# EAGLE design MacroKeypad (EAGLE 9.6.2)
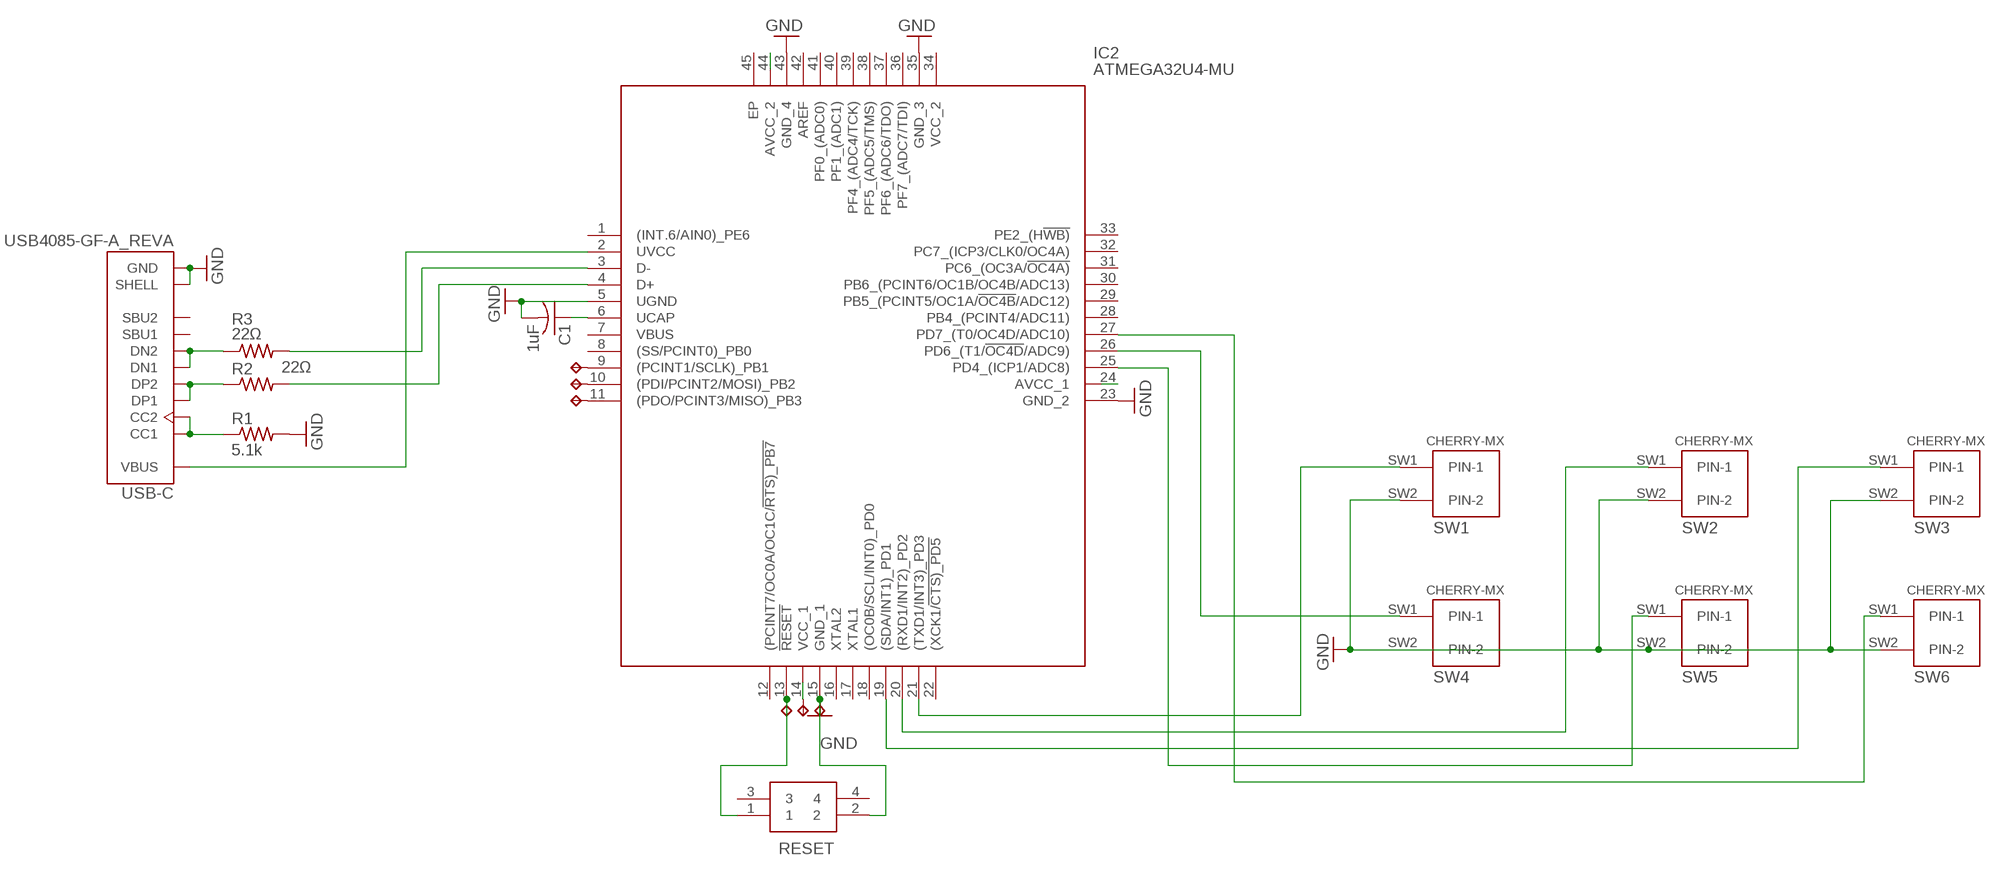
[diagram p0: schematic, sheet 1]

## Parts
5V  TPTP17R  [TP17R]
C1  1uF  C-USC0805  [C0805]
GND  TPTP17R  [TP17R]
IC2  ATMEGA32U4-MU  [QFN50P700X700X100-45N]
MISO  TPTP17R  [TP17R]
MOSI  TPTP17R  [TP17R]
R1  5.1k  R-US_R0603  [R0603]
R2  22Ω  R-US_R0805  [R0805]
R3  22Ω  R-US_R0805  [R0805]
RESET  LL3303F065QG  [LL3303F065QG]
RST  TPTP17R  [TP17R]
SCLK  TPTP17R  [TP17R]
SW1  CHERRY-MX  [CHERRY-MX]
SW2  CHERRY-MX  [CHERRY-MX]
SW3  CHERRY-MX  [CHERRY-MX]
SW4  CHERRY-MX  [CHERRY-MX]
SW5  CHERRY-MX  [CHERRY-MX]
SW6  CHERRY-MX  [CHERRY-MX]
USB-C  USB4085-GF-A_REVA  [GCT_USB4085-GF-A_REVA]

## Nets
CC: R1.1 USB-C.A5(CC1) USB-C.B5(CC2)
D+: R2.1 USB-C.A6(DP1) USB-C.B6(DP2)
D+RES: IC2.4(D+) R2.2
D-: R3.1 USB-C.A7(DN1) USB-C.B7(DN2)
D-RES: IC2.3(D-) R3.2
GND: C1.2 GND.TP IC2.5(UGND) IC2.15(GND_1) IC2.23(GND_2) IC2.35(GND_3) IC2.43(GND_4) R1.2 RESET.2 SW1.SW2(PIN-2) SW2.SW2(PIN-2) SW3.SW2(PIN-2) SW4.SW2(PIN-2) SW5.SW2(PIN-2) SW6.SW2(PIN-2) USB-C.A1(GND) USB-C.A12(GND) USB-C.B1(GND) USB-C.B12(GND) USB-C.P1(SHELL) USB-C.P2(SHELL) USB-C.P3(SHELL) USB-C.P4(SHELL)
MISO: IC2.11((PDO/PCINT3/MISO)_PB3) MISO.TP
MOSI: IC2.10((PDI/PCINT2/MOSI)_PB2) MOSI.TP
RESET: IC2.13(!RESET) RESET.1 RST.TP
SCLK: IC2.9((PCINT1/SCLK)_PB1) SCLK.TP
SW1: IC2.21((TXD1/INT3)_PD3) SW1.SW1(PIN-1)
SW2: IC2.20((RXD1/INT2)_PD2) SW2.SW1(PIN-1)
SW3: IC2.19((SDA/INT1)_PD1) SW3.SW1(PIN-1)
SW4: IC2.26(PD6_(T1/!OC4D!/ADC9)) SW4.SW1(PIN-1)
SW5: IC2.25(PD4_(ICP1/ADC8)) SW5.SW1(PIN-1)
SW6: IC2.27(PD7_(T0/OC4D/ADC10)) SW6.SW1(PIN-1)
UCAP: C1.1 IC2.6(UCAP)
VCC: 5V.TP IC2.14(VCC_1) IC2.24(AVCC_1) IC2.44(AVCC_2)
VIN: IC2.2(UVCC) USB-C.A4(VBUS) USB-C.A9(VBUS) USB-C.B4(VBUS) USB-C.B9(VBUS)
Unconnected: IC2.1((INT.6/AIN0)_PE6) IC2.7(VBUS) IC2.8((SS/PCINT0)_PB0) IC2.12((PCINT7/OC0A/OC1C/!RTS)_PB7) IC2.16(XTAL2) IC2.17(XTAL1) IC2.18((OC0B/SCL/INT0)_PD0) IC2.22((XCK1/!CTS)_PD5) IC2.28(PB4_(PCINT4/ADC11)) IC2.29(PB5_(PCINT5/OC1A/!OC4B!/ADC12)) IC2.30(PB6_(PCINT6/OC1B/OC4B/ADC13)) IC2.31(PC6_(OC3A/!OC4A)) IC2.32(PC7_(ICP3/CLK0/OC4A)) IC2.33(PE2_(H!WB)) IC2.34(VCC_2) IC2.36(PF7_(ADC7/TDI)) IC2.37(PF6_(ADC6/TDO)) IC2.38(PF5_(ADC5/TMS)) IC2.39(PF4_(ADC4/TCK)) IC2.40(PF1_(ADC1)) IC2.41(PF0_(ADC0)) IC2.42(AREF) IC2.45(EP) RESET.3 RESET.4 USB-C.A8(SBU1) USB-C.B8(SBU2)

## Library data of the parts
5V GND MISO MOSI RST SCLK = testpad:TP: Test pad
C1 = adafruit:C-US: CAPACITOR, American symbol
IC2 = SamacSys_Parts:ATMEGA32U4-MU: MCU 8-bit ATmega AVR RISC 32KB Flash Atmel ATMEGA32U4-MU, 8bit AVR Microcontroller, 16MHz, 32 kB Flash, 44-Pin QFN Source: Datasheet <https://componentsearchengine.com/Datasheets/2/ATMEGA32U4-MU.pdf>; DESCRIPTION: MCU 8-bit ATmega AVR RISC 32KB Flash Atmel ATMEGA32U4-MU, 8bit AVR Microcontroller, 16MHz, 32 kB Flash, 44-Pin QFN; HEIGHT: 1mm; MANUFACTURER_NAME: Microchip; MANUFACTURER_PART_NUMBER: ATMEGA32U4-MU; MOUSER_PART_NUMBER: 556-ATMEGA32U4-MU; MOUSER_PRICE-STOCK: https://www.mouser.co.uk/ProductDetail/Microchip-Technology-Atmel/ATMEGA32U4-MU?qs=JV7lzlMm3yJYRpi0cY3cKw%3D%3D
R1-R3 = adafruit:R-US_: RESISTOR, American symbol
RESET = SamacSys_Parts:LL3303F065QG: Pushbutton Switches 50mA 12VDC F065 7.0mm Gull Wing Source: Datasheet <http://spec_sheets.e-switch.com/specs/P090008.pdf>; DESCRIPTION: Pushbutton Switches 50mA 12VDC F065 7.0mm Gull Wing; HEIGHT: 3.4mm; MANUFACTURER_NAME: E-Switch; MANUFACTURER_PART_NUMBER: LL3303F065QG; MOUSER_PART_NUMBER: 612-LL3303F065QG; MOUSER_PRICE-STOCK: https://www.mouser.co.uk/ProductDetail/E-Switch/LL3303F065QG?qs=QtyuwXswaQjocAyEnLyPSg%3D%3D
SW1-SW6 = cherrymx:CHERRY-MX: Cherry MX series keyswitch
USB-C = USB4085-GF-A_REVA:USB4085-GF-A_REVA: USB 2.0 Type C Receptacle Dip Type, PCB Top Mount Check prices <https://pricing.snapeda.com/parts/USB4085-GF-A/Global%20Connector%20Technology/view-part?ref=eda>; AVAILABILITY: Warning; DESCRIPTION: USB-C (USB TYPE-C) USB 2.0 Receptacle Connector 24 (16+8 Dummy) Position Through Hole, Right Angle; MF: Global Connector Technology; MP: USB4085-GF-A; PACKAGE: Package; PRICE: None; PURCHASE-URL: https://pricing.snapeda.com/search/part/USB4085-GF-A/?ref=eda

## Board
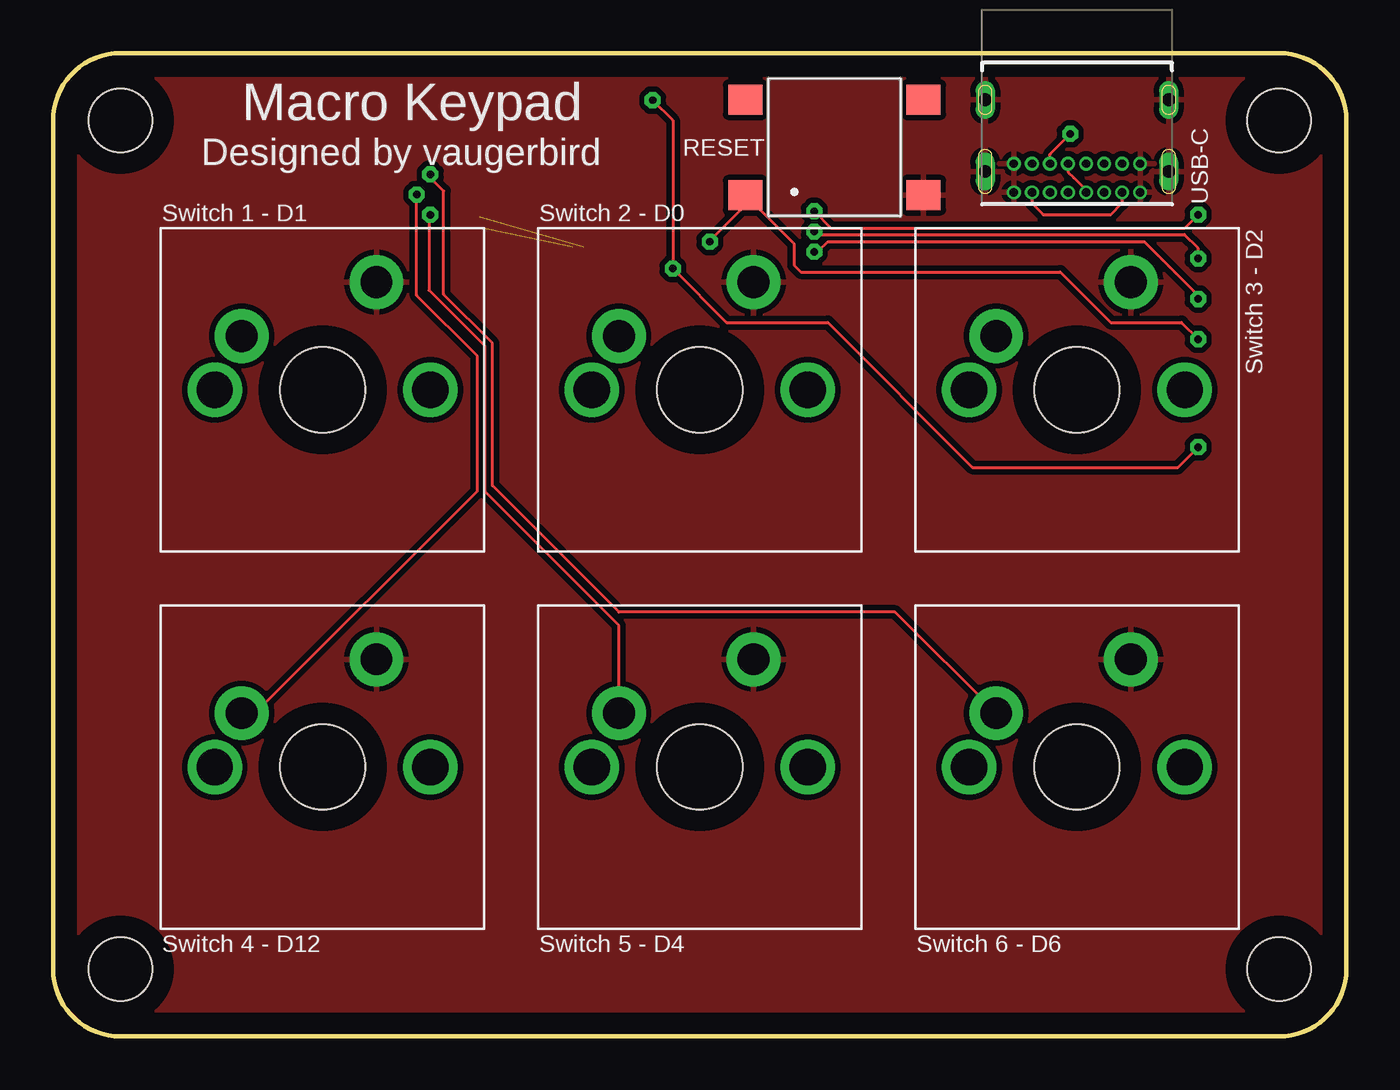
[diagram p1: board, top side]
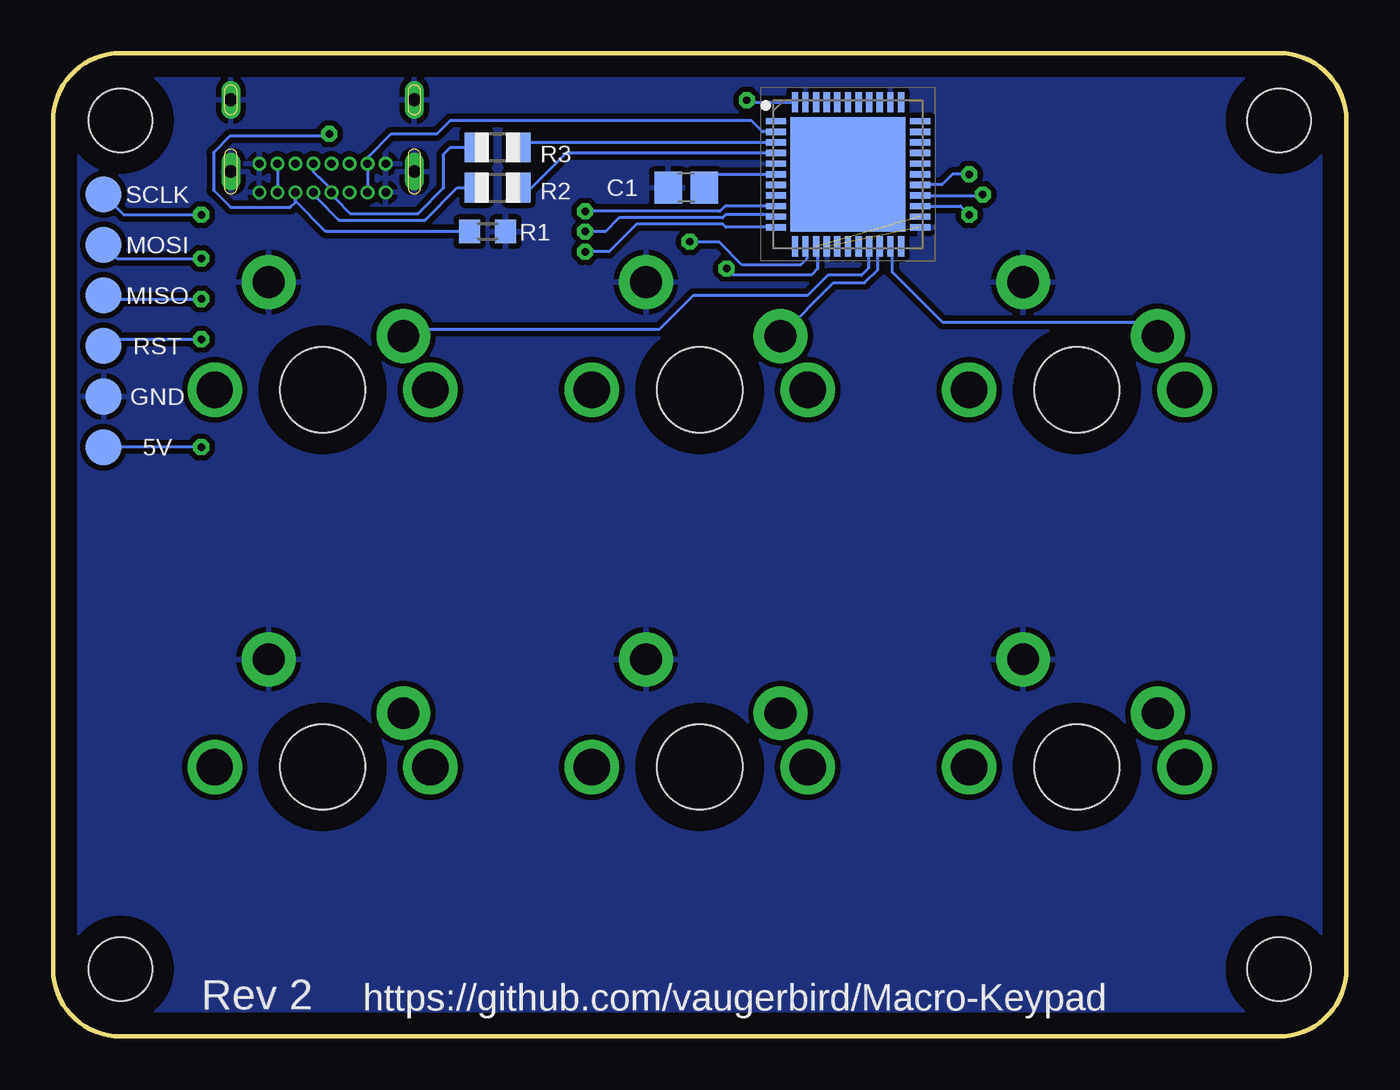
[diagram p2: board, bottom side, seen from below]

Size 60.96 x 46.35 mm. Coordinates in mm from the lower left corner, seen from the top.
Outline: 3.18,0 57.79,0 arc90 60.96,3.17 60.96,43.18 arc90 57.79,46.35 3.18,46.35 arc90 0,43.18 0,3.17 arc90 3.18,0
Copper layers (1*16): Top 0.035mm / dielectric 1.5mm / Bottom 0.035mm
Design rules "default *": minimum track width 6mil, minimum drill 0.35mm, track to track 6mil, track to pad 6mil, pad to pad 6mil, via to via 6mil, smd to smd 6mil, copper to edge 40mil, drill to drill 6mil, minimum pad ring 4mil, minimum via ring 8mil, stop-mask expansion 4mil, vias tented up to drill 0mil, thermal gap 10mil
Holes 3 mm at 57.79,3.17 57.79,43.18 3.18,3.17 3.18,43.18

### Footprints (pad centres in the part's own frame; a part is rotated, then mirrored left to right if it is on the bottom)
TP17R = smd 1.7 x 1.7: TP 0,0
C0805 = smd 1.3 x 1.5: 1 -0.85,0; 2 0.85,0
QFN50P700X700X100-45N = smd 0.95 x 0.3: 1 -3.4,2.5; 2 -3.4,2; 3 -3.4,1.5; 4 -3.4,1; 5 -3.4,0.5; 6 -3.4,0; 7 -3.4,-0.5; 8 -3.4,-1; 9 -3.4,-1.5; 10 -3.4,-2; 11 -3.4,-2.5; 23 3.4,-2.5; 24 3.4,-2; 25 3.4,-1.5; 26 3.4,-1; 27 3.4,-0.5; 28 3.4,0; 29 3.4,0.5; 30 3.4,1; 31 3.4,1.5; 32 3.4,2; 33 3.4,2.5 | smd 0.3 x 0.95: 12 -2.5,-3.4; 13 -2,-3.4; 14 -1.5,-3.4; 15 -1,-3.4; 16 -0.5,-3.4; 17 0,-3.4; 18 0.5,-3.4; 19 1,-3.4; 20 1.5,-3.4; 21 2,-3.4; 22 2.5,-3.4; 34 2.5,3.4; 35 2,3.4; 36 1.5,3.4; 37 1,3.4; 38 0.5,3.4; 39 0,3.4; 40 -0.5,3.4; 41 -1,3.4; 42 -1.5,3.4; 43 -2,3.4; 44 -2.5,3.4 | smd 5.4 x 5.4: 45 0,0
R0603 = smd 1 x 1.1: 1 -0.85,0; 2 0.85,0
R0805 = smd 1.1 x 1.4: 1 -1,0; 2 1,0
LL3303F065QG = smd 1.6 x 1.4: 1 -4.2,-2.25; 2 4.2,-2.25; 3 -4.2,2.25; 4 4.2,2.25
CHERRY-MX = drill 1.714 pad 1.93: P$3 -5.08,0; P$4 5.08,0 | drill 1.5 pad 2.54: SW1 -3.81,2.54; SW2 2.54,5.08 | hole 4: 0,0
GCT_USB4085-GF-A_REVA = drill 0.4 pad 0.65: A1 -2.975,4.025; A4 -2.125,4.025; A5 -1.275,4.025; A6 -0.425,4.025; A7 0.425,4.025; A8 1.275,4.025; A9 2.125,4.025; A12 2.975,4.025; B1 2.975,2.675; B4 2.125,2.675; B5 1.275,2.675; B6 0.425,2.675; B7 -0.425,2.675; B8 -1.275,2.675; B9 -2.125,2.675; B12 -2.975,2.675 | drill 0.6 long: P1 -4.325,3.045; P2 4.325,3.045; P3 4.325,-0.335; P4 -4.325,-0.335

### Placement (x,y rotation side)
5V  58.58,27.78 0 bottom
C1  31.12,40.01 180 bottom
GND  58.58,30.16 0 bottom
IC2  23.49,40.64 0 bottom
MISO  58.58,34.93 0 bottom
MOSI  58.58,37.31 0 bottom
R1  40.48,37.94 0 bottom
R2  40.01,40.01 0 bottom
R3  40.01,41.91 0 bottom
RESET  36.83,41.91 0 top
RST  58.58,32.54 0 bottom
SCLK  58.58,39.69 0 bottom
SW1  12.7,30.48 0 top
SW2  30.48,30.48 0 top
SW3  48.26,30.48 0 top
SW4  12.7,12.7 0 top
SW5  30.48,12.7 0 top
SW6  48.26,12.7 0 top
USB-C  48.26,43.82 180 top

### Tracks (layer width: path | path; a pad name or v marks a point on that pad's centre or on a via)
CC  (via drill 0.35)
  Top 0.152: USB-C.B5 46.99,41.59 v47.94,42.54
  Bottom 0.152: R1.1 48.1,37.94 49.54,39.37 | 49.54,39.37 49.54,39.69 | 49.54,39.69 USB-C.A5 | 49.54,39.68 49.54,39.69 | v47.94,42.54 47.94,42.45 52.6,42.45 53.39,41.66 53.39,39.88 52.59,39.08 49.77,39.08 49.54,39.32 49.54,39.37
D+
  Top 0.152: USB-C.B6 47.84,40.75 48.11,40.47 48.12,40.47 48.68,39.9 USB-C.A6
  Bottom 0.152: USB-C.A6 48.52,39.62 48.52,39.51 47.49,38.48 43.43,38.48 41.91,40.01 R2.1
D+RES
  Bottom 0.152: IC2.4 36.78,41.64 38.42,40.01 R2.2
D-
  Bottom 0.152: USB-C.B7 48.68,40.75 48.41,40.47 48.4,40.47 47.84,39.9 USB-C.A7 47.67,39.62 47.67,39.51 46.95,38.79 43.76,38.79 42.54,40.01 42.54,41.59 42.23,41.91 R3.1
D-RES
  Bottom 0.152: IC2.3 38.77,42.14 R3.2
GND  (1 unrouted)
  pour Top (isolate 0.254): 0,0 0,46.35 60.96,46.35 60.96,0
  pour Bottom (isolate 0.254): 0,46.35 0,0 60.96,0 60.96,46.35
MISO  (via drill 0.35)
  Top 0.152: v35.88,36.99 36.04,36.99 36.51,37.46 51.43,37.46 53.98,34.93 v53.98,34.77
  Bottom 0.152: IC2.11 29.25,38.14 29.39,38.28 33.47,38.28 34.77,36.99 v35.88,36.99 | v53.98,34.77 58.42,34.77 MISO.TP
MOSI  (via drill 0.35)
  Top 0.152: v35.88,37.94 35.92,37.94 36.07,37.79 53.33,37.79 53.98,37.15 v53.98,36.67
  Bottom 0.152: IC2.10 26.99,38.73 29.26,38.73 29.4,38.59 34.28,38.59 34.93,37.94 v35.88,37.94 | MOSI.TP 57.94,36.67 v53.98,36.67
RESET  (via drill 0.35)
  Top 0.152: v30.96,37.46 30.93,37.49 32.63,39.18 RESET.1 34.93,37.37 34.93,36.35 35.24,36.04 47.47,36.04 49.85,33.66 53.18,33.66 v53.98,32.86
  Bottom 0.152: v30.96,37.46 v30.95,37.46 29.58,37.46 28.49,36.37 25.73,36.37 25.43,36.66 25.43,37.18 IC2.13 | v53.98,32.86 58.26,32.86 RST.TP
SCLK  (via drill 0.35)
  Top 0.152: v35.88,38.89 36.67,38.1 53.34,38.1 v53.98,38.73
  Bottom 0.152: 26.97,39.21 IC2.9 29.28,39.14 29.53,38.89 v35.88,38.89 | SCLK.TP 57.63,38.73 v53.98,38.73
SW1
  Bottom 0.152: SW1.SW1 9.52,33.66 19.03,33.66 21.4,36.02 21.4,37.14 IC2.21
SW2
  Bottom 0.152: SW2.SW1 24.17,35.52 22.71,35.52 22.09,36.14 22.09,37.14 IC2.20
SW3
  Bottom 0.152: SW3.SW1 44.13,33.34 32.38,33.34 30.8,34.93 25.4,34.93 24.45,35.88 22.86,35.88 22.49,36.24 IC2.19
SW4  (via drill 0.35)
  Top 0.152: SW4.SW1 9.52,15.24 20,25.72 20,32.07 17.15,34.93 v17.15,39.69
  Bottom 0.152: IC2.26 17.19,39.64 v17.15,39.69
SW5  (via drill 0.35)
  Top 0.152: SW5.SW1 26.67,19.37 20.36,25.68 20.36,32.53 17.71,35.18 17.71,38.73 v17.78,38.73
  Bottom 0.152: IC2.25 18.19,39.14 v17.78,38.73
SW6  (via drill 0.35)
  Top 0.152: SW6.SW1 39.69,20 26.67,20 20.71,25.96 20.71,32.68 18.41,34.98 18.41,39.85 17.78,40.48 v17.78,40.64
  Bottom 0.152: v17.78,40.64 18.57,40.64 19.07,40.14 IC2.27
UCAP
  Bottom 0.152: C1.1 29.63,40.64 IC2.6
VCC  (via drill 0.35)  (1 unrouted)
  Top 0.152: v28.26,44.13 29.21,43.18 v29.21,36.2 31.75,33.66 36.51,33.66 43.34,26.83 53.02,26.83 v53.98,27.78
  Bottom 0.152: IC2.14 24.93,37.18 24.93,36.18 25.2,35.92 28.93,35.92 v29.21,36.2 | v28.26,44.13 28.12,44.13 28.03,44.04 IC2.44 | v53.98,27.78 5V.TP
VIN
  Top 0.152: USB-C.A4 50.38,39.27 49.85,38.73 46.67,38.73 46.13,39.27 USB-C.A9
  Bottom 0.152: IC2.2 27.52,42.64 28.06,43.18 42.23,43.18 42.86,42.54 45.02,42.54 46.1,41.48 46.1,41.18 USB-C.B4 USB-C.A9 | USB-C.B9 USB-C.A4

### Text on the board
tNames: Macro Keypad | Designed by vaugerbird | Switch 1 - D1 | Switch 2 - D0 | Switch 3 - D2 | Switch 4 - D12 | Switch 5 - D4 | Switch 6 - D6
bNames: https://github.com/vaugerbird/Macro-Keypad | Rev 2